# EAGLE design Cube (EAGLE 9.6.2)
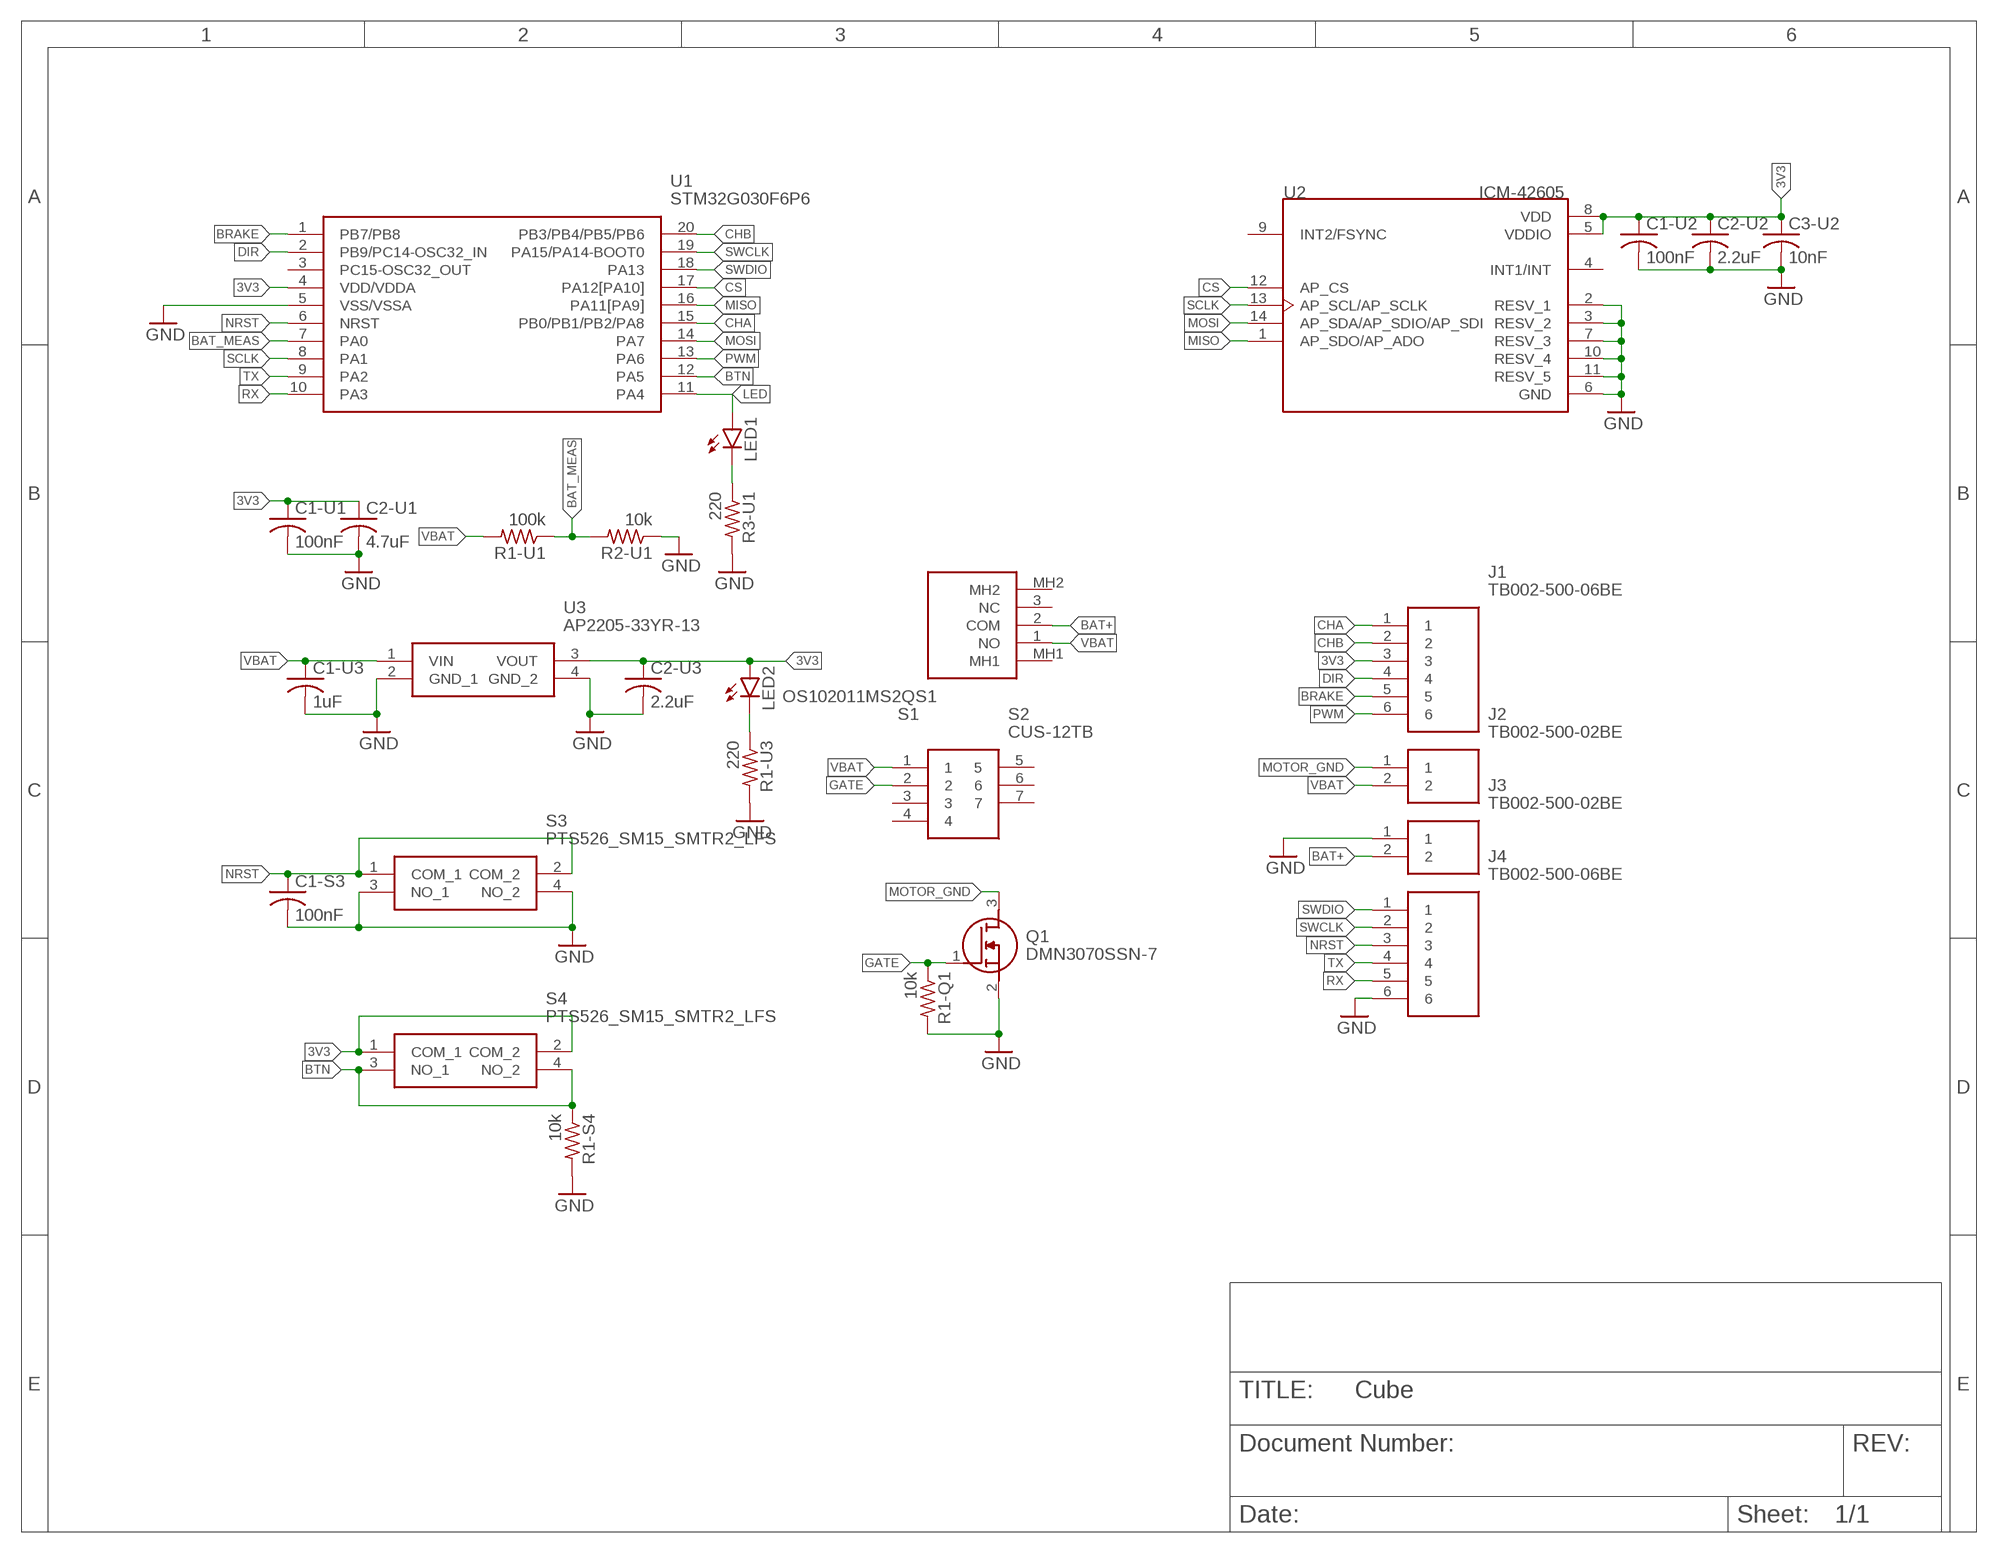
[diagram p0: schematic, sheet 1]

## Parts
C1-S3  100nF  C-USC0805  [C0805]
C1-U1  100nF  C-USC0805  [C0805]
C1-U2  100nF  C-USC0805  [C0805]
C1-U3  1uF  C-USC0805  [C0805]
C2-U1  4.7uF  C-USC0805  [C0805]
C2-U2  2.2uF  C-USC0805  [C0805]
C2-U3  2.2uF  C-USC0805  [C0805]
C3-U2  10nF  C-USC0805  [C0805]
J1  TB002-500-06BE  [TB00250006BE]
J2  TB002-500-02BE  [TB00250002BE]
J3  TB002-500-02BE  [TB00250002BE]
J4  TB002-500-06BE  [TB00250006BE]
LED1  LEDCHIP-LED0805  [CHIP-LED0805]
LED2  LEDCHIP-LED0805  [CHIP-LED0805]
Q1  DMN3070SSN-7  [SOT95P285X140-3N]
R1-Q1  10k  R-US_R0805  [R0805]
R1-S4  10k  R-US_R0805  [R0805]
R1-U1  100k  R-US_R0805  [R0805]
R1-U3  220  R-US_R0805  [R0805]
R2-U1  10k  R-US_R0805  [R0805]
R3-U1  220  R-US_R0805  [R0805]
S1  OS102011MS2QS1  [OS102011MS2QS1]
S2  CUS-12TB  [CUS-12B]
S3  PTS526_SM15_SMTR2_LFS  [PTS526SM15SMTR2LFS]
S4  PTS526_SM15_SMTR2_LFS  [PTS526SM15SMTR2LFS]
U1  STM32G030F6P6  [SOP65P640X120-20N]
U2  ICM-42605  [PQFN50P300X250X97-14N]
U3  AP2205-33YR-13  [AP220533YR13]

## Nets
3V3: C1-U1.1 C1-U2.1 C2-U1.1 C2-U2.1 C2-U3.1 C3-U2.1 J1.3 LED2.A S4.1(COM_1) S4.2(COM_2) U1.4(VDD/VDDA) U2.5(VDDIO) U2.8(VDD) U3.3(VOUT)
BAT+: J3.2 S1.2(COM)
BAT_MEAS: R1-U1.1 R2-U1.2 U1.7(PA0)
BRAKE: J1.5 U1.1(PB7/PB8)
BTN: R1-S4.1 S4.3(NO_1) S4.4(NO_2) U1.12(PA5)
CHA: J1.1 U1.15(PB0/PB1/PB2/PA8)
CHB: J1.2 U1.20(PB3/PB4/PB5/PB6)
CS: U1.17(PA12[PA10]) U2.12(AP_CS)
DIR: J1.4 U1.2(PB9/PC14-OSC32_IN)
GATE: Q1.1(G) R1-Q1.1 S2.2
GND: C1-S3.2 C1-U1.2 C1-U2.2 C1-U3.2 C2-U1.2 C2-U2.2 C2-U3.2 C3-U2.2 J3.1 J4.6 Q1.2(S) R1-Q1.2 R1-S4.2 R1-U3.2 R2-U1.1 R3-U1.2 S3.3(NO_1) S3.4(NO_2) U1.5(VSS/VSSA) U2.2(RESV_1) U2.3(RESV_2) U2.6(GND) U2.7(RESV_3) U2.10(RESV_4) U2.11(RESV_5) U3.2(GND_1) U3.4(GND_2)
LED: LED1.A U1.11(PA4)
LED1-R: LED1.C R3-U1.1
LED2-R: LED2.C R1-U3.1
MISO: U1.16(PA11[PA9]) U2.1(AP_SDO/AP_ADO)
MOSI: U1.14(PA7) U2.14(AP_SDA/AP_SDIO/AP_SDI)
MOTOR_GND: J2.1 Q1.3(D)
NRST: C1-S3.1 J4.3 S3.1(COM_1) S3.2(COM_2) U1.6(NRST)
PWM: J1.6 U1.13(PA6)
RX: J4.5 U1.10(PA3)
SCLK: U1.8(PA1) U2.13(AP_SCL/AP_SCLK)
SWCLK: J4.2 U1.19(PA15/PA14-BOOT0)
SWDIO: J4.1 U1.18(PA13)
TX: J4.4 U1.9(PA2)
VBAT: C1-U3.1 J2.2 R1-U1.2 S1.1(NO) S2.1 U3.1(VIN)
Unconnected: S1.3(NC) S1.MH1 S1.MH2 S2.3 S2.4 S2.5 S2.6 S2.7 U1.3(PC15-OSC32_OUT) U2.4(INT1/INT) U2.9(INT2/FSYNC)

## Library data of the parts
C1-S3 C1-U1-C1-U3 C2-U1-C2-U3 C3-U2 = rcl:C-US: CAPACITOR, American symbol; SPICEPREFIX: C
J1 J4 = SamacSys_Parts:TB002-500-06BE: Fixed Terminal Blocks screw type, 5.00 , horizontal, 6 poles, CUI Blue, slotted screw, PCB mount Source: Datasheet <https://componentsearchengine.com/Datasheets/1/TB002-500-06BE.pdf>; DESCRIPTION: Fixed Terminal Blocks screw type, 5.00 , horizontal, 6 poles, CUI Blue, slotted screw, PCB mount; HEIGHT: 10.4mm; MANUFACTURER_NAME: CUI Inc.; MANUFACTURER_PART_NUMBER: TB002-500-06BE; MOUSER_PART_NUMBER: 490-TB002-500-06BE; MOUSER_PRICE-STOCK: https://www.mouser.co.uk/ProductDetail/CUI-Devices/TB002-500-06BE?qs=vLWxofP3U2ySaC9Fwbz1OQ%3D%3D
J2 J3 = SamacSys_Parts:TB002-500-02BE: Fixed Terminal Blocks Terminal block, screw type, 5.00, horizontal, 2 poles, CUI Blue, slotted screw, PCB mount Source: Datasheet; DESCRIPTION: Fixed Terminal Blocks Terminal block, screw type, 5.00, horizontal, 2 poles, CUI Blue, slotted screw, PCB mount; HEIGHT: 10.4mm; MANUFACTURER_NAME: CUI Inc.; MANUFACTURER_PART_NUMBER: TB002-500-02BE; MOUSER_PART_NUMBER: 490-TB002-500-02BE; MOUSER_PRICE-STOCK: https://www.mouser.co.uk/ProductDetail/CUI-Devices/TB002-500-02BE?qs=vLWxofP3U2x9716kcgva%2Fw%3D%3D
LED1 LED2 = led:LED: LED OSRAM: - CHIPLED LG R971, LG N971, LY N971, LG Q971, LY Q971, LO R971, LY R971 LH N974, LH R974 LS Q976, LO Q976, LY Q976 LO Q996 - Hyper CHIPLED LW Q18S LB Q993, LB Q99A, LB R99A - SideLED LS A670, LO A670, LY A670, LG A670, LP A670 LB A673, LV A673, LT A673, LW A673 LH A674 LY A675 LS A676, LA A676, LO A676, LY A676, LW A676 LS A679, LY A679, LG A679 - Hyper Micro SIDELED® LS Y876, LA Y876, LO Y876, LY Y876 LT Y87S - SmartLED LW L88C, LW L88S LB L89C, LB L89S, LG L890 LS L89K, LO L89K, LY L89K LS L896, LA L896, LO L896, LY L896 - TOPLED LS T670, LO T670, LY T670, LG T670, LP T670 LSG T670, LSP T670, LSY T670, LOP T670, LYG T670 LG T671, LOG T671, LSG T671 LB T673, LV T673, LT T673, LW T673 LH T674 LS T676, LA T676, LO T676, LY T676, LB T676, LH T676, LSB T676, LW T676 LB T67C, LV T67C, LT T67C, LS T67K, LO T67K, LY T67K, LW E67C LS E67B, LA E67B, LO E67B, LY E67B, LB E67C, LV E67C, LT E67C LW T67C LS T679, LY T679, LG T679 LS T770, LO T770, LY T770, LG T770, LP T770 LB T773, LV T773, LT T773, LW T773 LH T774 LS E675, LA E675, LY E675, LS T675 LS T776, LA T776, LO T776, LY T776, LB T776 LHGB T686 LT T68C, LB T68C - Hyper Mini TOPLED® LB M676 - Mini TOPLED Santana® LG M470 LS M47K, LO M47K, LY M47K Source: http://www.osram.convergy.de LUXEON: - LUMILED® LXK2-PW12-R00, LXK2-PW12-S00, LXK2-PW14-U00, LXK2-PW14-V00 LXK2-PM12-R00, LXK2-PM12-S00, LXK2-PM14-U00 LXK2-PE12-Q00, LXK2-PE12-R00, LXK2-PE12-S00, LXK2-PE14-T00, LXK2-PE14-U00 LXK2-PB12-K00, LXK2-PB12-L00, LXK2-PB12-M00, LXK2-PB14-N00, LXK2-PB14-P00, LXK2-PB14-Q00 LXK2-PR12-L00, LXK2-PR12-M00, LXK2-PR14-Q00, LXK2-PR14-R00 LXK2-PD12-Q00, LXK2-PD12-R00, LXK2-PD12-S00 LXK2-PH12-R00, LXK2-PH12-S00 LXK2-PL12-P00, LXK2-PL12-Q00, LXK2-PL12-R00 Source: www.luxeon.com KINGBRIGHT: KA-3528ASYC Source: www.kingbright.com
Q1 = SamacSys_Parts:DMN3070SSN-7: Diodes Inc DMN3070SSN-7 N-channel MOSFET Transistor, 5.1 A, 30 V, 3-Pin SC-59 Source: Datasheet <https://www.diodes.com/assets/Datasheets/DMN3070SSN.pdf>; DESCRIPTION: Diodes Inc DMN3070SSN-7 N-channel MOSFET Transistor, 5.1 A, 30 V, 3-Pin SC-59; HEIGHT: 1.4mm; MANUFACTURER_NAME: Diodes Inc.; MANUFACTURER_PART_NUMBER: DMN3070SSN-7; MOUSER_PART_NUMBER: 621-DMN3070SSN-7; MOUSER_PRICE-STOCK: https://www.mouser.co.uk/ProductDetail/Diodes-Incorporated/DMN3070SSN-7?qs=%252BSlWJf1dfkL0soPvBL8r%2FQ%3D%3D
R1-Q1 R1-S4 R1-U1 R1-U3 R2-U1 R3-U1 = rcl:R-US_: RESISTOR, American symbol; SPICEPREFIX: R
S1 = SamacSys_Parts:OS102011MS2QS1: C & K COMPONENTS - OS102011MS2QS1 - SWITCH SLIDE SHORTING SPDT Source: Datasheet <https://www.ckswitches.com/media/1428/os.pdf>; DESCRIPTION: C & K COMPONENTS - OS102011MS2QS1 - SWITCH SLIDE SHORTING SPDT; HEIGHT: 8.7mm; MANUFACTURER_NAME: C & K COMPONENTS; MANUFACTURER_PART_NUMBER: OS102011MS2QS1; MOUSER_PART_NUMBER: 611-OS102011MS2QS1; MOUSER_PRICE-STOCK: https://www.mouser.co.uk/ProductDetail/CK/OS102011MS2QS1?qs=WtljUlYws5TrGs9OfHrZYw%3D%3D
S2 = SamacSys_Parts:CUS-12TB: LOW-PROFILE SLIDE SWITCHES Source: Datasheet <http://www.nidec-copal-electronics.com/e/catalog/switch/cus.pdf>; DESCRIPTION: LOW-PROFILE SLIDE SWITCHES; HEIGHT: mm; MANUFACTURER_NAME: Copal Electronics; MANUFACTURER_PART_NUMBER: CUS-12TB
S3 S4 = SamacSys_Parts:PTS526_SM15_SMTR2_LFS: Tactile Switches 50mA 12VDC, 5.2x5.2mm, 1.5mm H, 160gf, G leads, No ground pin, metal actuator Source: Datasheet; DESCRIPTION: Tactile Switches 50mA 12VDC, 5.2x5.2mm, 1.5mm H, 160gf, G leads, No ground pin, metal actuator; HEIGHT: 1.5mm; MANUFACTURER_NAME: C & K COMPONENTS; MANUFACTURER_PART_NUMBER: PTS526 SM15 SMTR2 LFS; MOUSER_PART_NUMBER: 611-PTS526SM15SMTR2L; MOUSER_PRICE-STOCK: https://www.mouser.co.uk/ProductDetail/CK/PTS526-SM15-SMTR2-LFS?qs=UXgszm6BlbENivbslIA%252B5g%3D%3D
U1 = SamacSys_Parts:STM32G030F6P6: ARM Microcontrollers - MCU Source: Datasheet <https://componentsearchengine.com/Datasheets/1/STM32G030F6P6.pdf>; DESCRIPTION: ARM Microcontrollers - MCU; HEIGHT: 1.2mm; MANUFACTURER_NAME: STMicroelectronics; MANUFACTURER_PART_NUMBER: STM32G030F6P6; MOUSER_PART_NUMBER: 511-STM32G030F6P6; MOUSER_PRICE-STOCK: https://www.mouser.co.uk/ProductDetail/STMicroelectronics/STM32G030F6P6?qs=uwxL4vQweFOQRcVHghCbHA%3D%3D
U2 = ICM-42605:ICM-42605: Single-Interface MotionTracking device The ICM-42605 is a 6-axis MotionTracking device that combines a 3-axis gyroscope, and a 3-axis accelerometer in a small 2.5x3x0.91 mm (14-pin LGA) package. It also features a 2K-byte FIFO that can lower the traffic on the serial bus interface, and reduce power consumption by allowing the system processor to burst read sensor data and then go into a low-power mode. Check availability <https://pricing.snapeda.com/parts/ICM-42605/TDK%20InvenSense/view-part?ref=eda>; AVAILABILITY: In Stock; DESCRIPTION: Accelerometer, Gyroscope, 6 Axis Sensor I²C, I3C℠, SPI Output; MF: TDK InvenSense; MP: ICM-42605; PACKAGE: - TDK InvenSense; PRICE: None; PURCHASE-URL: https://pricing.snapeda.com/search/part/ICM-42605/?ref=eda
U3 = SamacSys_Parts:AP2205-33YR-13: LDO Voltage Regulators LDO CMOS LowCurr Source: Datasheet <https://www.diodes.com/assets/Datasheets/AP2205.pdf>; DESCRIPTION: LDO Voltage Regulators LDO CMOS LowCurr; HEIGHT: 1.6mm; MANUFACTURER_NAME: Diodes Inc.; MANUFACTURER_PART_NUMBER: AP2205-33YR-13; MOUSER_PART_NUMBER: 621-AP2205-33YR-13; MOUSER_PRICE-STOCK: https://www.mouser.co.uk/ProductDetail/Diodes-Incorporated/AP2205-33YR-13?qs=EBDBlbfErPxr2Yd8HvuLMQ%3D%3D

## Board
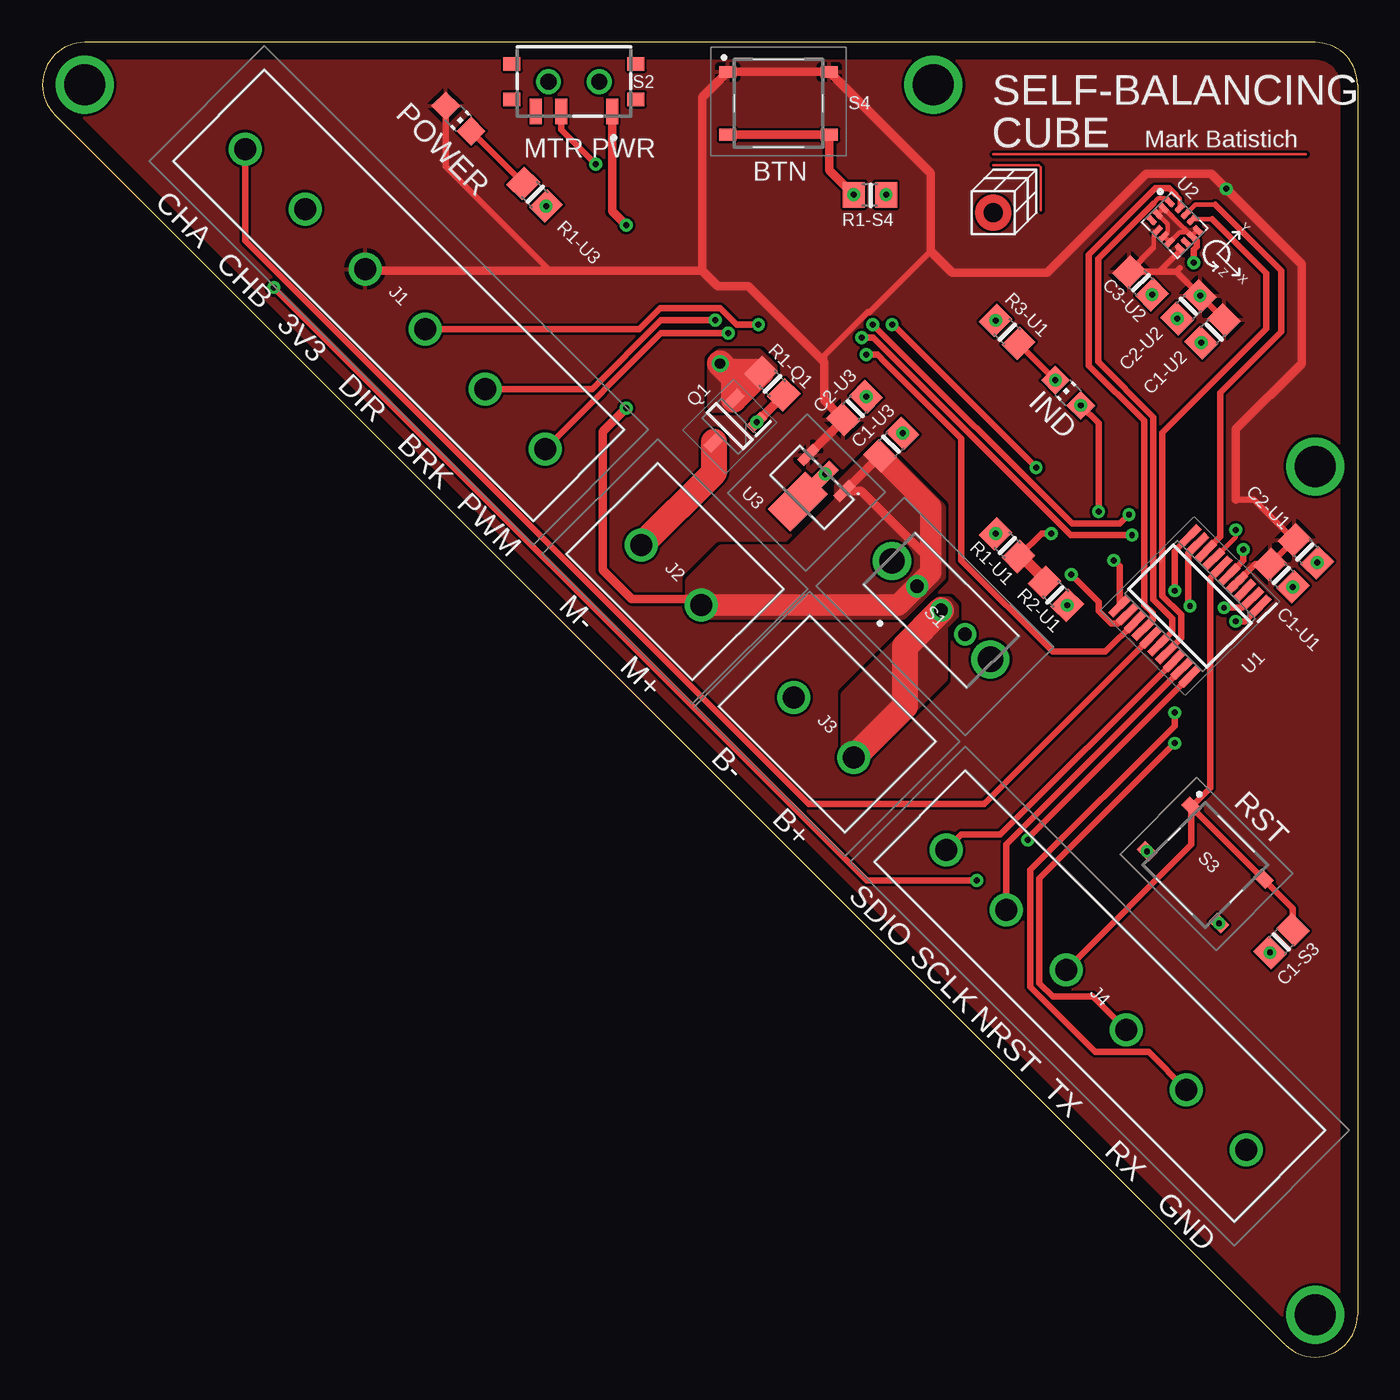
[diagram p1: board, top side]
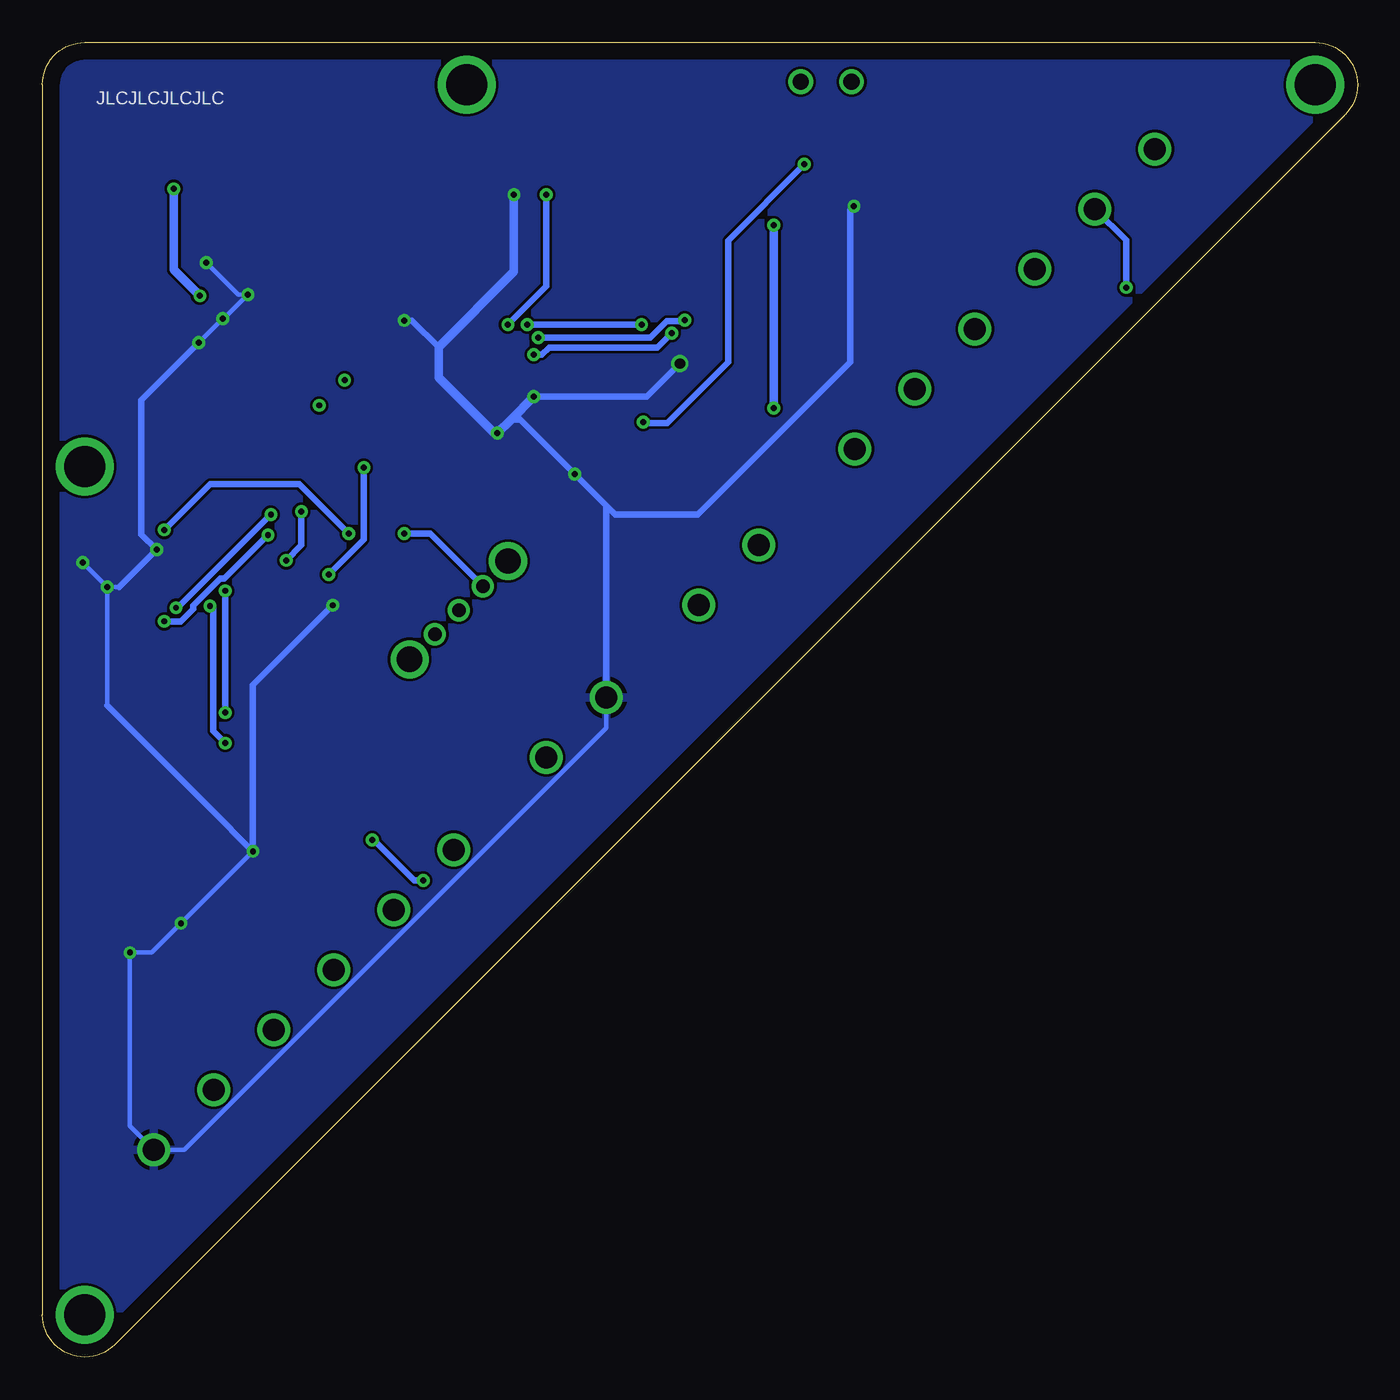
[diagram p2: board, bottom side, seen from below]

Size 77.5 x 77.5 mm. Coordinates in mm from the lower left corner, seen from the top.
Outline: 74.99,77.5 2.5,77.5 arc135 0.73,73.23 73.23,0.73 arc135 77.49,2.5 77.49,75 arc90 74.99,77.5
Copper layers (1*16): Top 0.035mm / dielectric 1.5mm / Bottom 0.035mm
Design rules "default": minimum track width 6mil, minimum drill 0.35mm, track to track 6mil, track to pad 6mil, pad to pad 6mil, via to via 6mil, smd to smd 6mil, copper to edge 40mil, drill to drill 6mil, minimum pad ring 10mil, minimum via ring 8mil, stop-mask expansion 4mil, vias tented up to drill 0mil, thermal gap 10mil

### Footprints (pad centres in the part's own frame; a part is rotated, then mirrored left to right if it is on the bottom)
C0805 = smd 1.3 x 1.5: 1 -0.95,0; 2 0.95,0
TB00250006BE = drill 1.3 pad 1.95: 1 0,0; 2 5,0; 3 10,0; 4 15,0; 5 20,0; 6 25,0
TB00250002BE = drill 1.3 pad 1.95: 1 0,0; 2 5,0
CHIP-LED0805 = smd 1.2 x 1.2: A 0,-1.05; C 0,1.05
SOT95P285X140-3N = smd 1.15 x 0.6: 1 -1.3,0.95; 2 -1.3,-0.95; 3 1.3,0
R0805 = smd 1.3 x 1.5: 1 -0.95,0; 2 0.95,0
OS102011MS2QS1 = drill 0.8 pad 1.3: 1 0,0; 2 2,0; 3 4,0 | drill 1.5 pad 2.25: MH1 -2.1,0; MH2 6.1,0
CUS-12B = smd 0.7 x 1.5: 1 -2.25,1.75; 2 0.75,1.75; 3 2.25,1.75 | smd 1 x 0.8: 4 3.65,1.05; 5 3.65,-1.05; 6 -3.65,-1.05; 7 -3.65,1.05 | drill 0.95 pad 1.45: 8 -1.5,0; 9 1.5,0
PTS526SM15SMTR2LFS = smd 1 x 0.7: 1 -3,1.85; 2 3,1.85; 3 -3,-1.85; 4 3,-1.85
SOP65P640X120-20N = smd 1.475 x 0.45: 1 -2.938,2.925; 2 -2.938,2.275; 3 -2.938,1.625; 4 -2.938,0.975; 5 -2.938,0.325; 6 -2.938,-0.325; 7 -2.938,-0.975; 8 -2.938,-1.625; 9 -2.938,-2.275; 10 -2.938,-2.925; 11 2.938,-2.925; 12 2.938,-2.275; 13 2.938,-1.625; 14 2.938,-0.975; 15 2.938,-0.325; 16 2.938,0.325; 17 2.938,0.975; 18 2.938,1.625; 19 2.938,2.275; 20 2.938,2.925
PQFN50P300X250X97-14N = smd 0.61 x 0.35: 1 -1.16,0.75; 2 -1.16,0.25; 3 -1.16,-0.25; 4 -1.16,-0.75; 8 1.16,-0.75; 9 1.16,-0.25; 10 1.16,0.25; 11 1.16,0.75 | smd 0.35 x 0.61: 5 -0.5,-0.91; 6 0,-0.91; 7 0.5,-0.91; 12 0.5,0.91; 13 0,0.91; 14 -0.5,0.91
AP220533YR13 = smd 0.55 x 1.3: 1 -1.5,-1.192; 3 1.5,-1.192 | smd 0.8 x 1.475: 2 0,-1.102 | smd 1.85 x 3.125: 4 0,1.192

### Placement (x,y rotation side)
C1-S3  73.01,24.51 225 top
C1-U1  73.01,46.07 315 top
C1-U2  68.96,60.47 225 top
C1-U3  50.02,53.79 45 top
C2-U1  74.44,47.5 315 top
C2-U2  67.54,61.88 225 top
C2-U3  47.86,55.95 45 top
C3-U2  64.71,63.3 315 top
J1  11.94,71.21 315 top
J2  35.29,47.86 315 top
J3  44.27,38.88 315 top
J4  53.25,29.9 315 top
LED1  60.44,56.84 45 top
LED2  24.51,73.01 225 top
Q1  40.5,54.87 225 top
R1-Q1  43.01,57.38 135 top
R1-S4  48.76,68.52 0 top
R1-U1  56.84,47.86 135 top
R1-U3  29,68.52 315 top
R2-U1  59.72,44.99 135 top
R3-U1  56.84,60.44 135 top
S1  51.54,45.44 315 top
S2  31.32,75.18 180 top
S3  68.52,29 315 top
S4  43.37,73.91 0 top
U1  67.62,44.27 225 top
U2  66.72,66.72 315 top
U3  45.35,51.28 135 top

### Tracks (layer width: path | path; a pad name or v marks a point on that pad's centre or on a via)
3V3  (via drill 0.35)
  Top 0.254: 64.06,63.99 C3-U2.1 | 65.43,65.36 65.5,65.42 65.5,66.14 65.72,66.37 U2.5 | C1-U2.1
  Top 0.381: C1-U2.1 C2-U2.1 66.8,63.97 | 65.43,65.36 64.06,63.99 | 66.8,63.97 65.81,63.97 | 65.81,63.97 C3-U2.1 | 66.8,63.97 67.01,64.18 | 29.9,64.03 23.77,70.16 LED2.A | U1.4 71.47,46.74 C1-U1.1 C2-U1.1 | C2-U1.1 | C2-U1.1 71.39,50.56 70.31,50.56 | 52.35,65.18 48.75,61.58 48.62,61.58 46.07,59.03 46.07,58.64 | 65.81,63.97 67,65.16 67,65.36
  Top 0.508: U3.3 47.19,55.24 C2-U3.1 46.07,56.4 46.07,58.64 41.58,63.13 39.78,63.13 38.88,64.03 | 38.88,64.03 29.9,64.03 19.13,64.03 J1.3 | 38.88,64.03 38.88,74.27 S4.1 S4.2 52.35,69.78 52.35,65.18 53.62,63.91 59.21,63.91 65.05,69.75 68.86,69.75 v69.75,68.86 74.2,64.42 74.2,58.58 70.31,54.69 70.31,50.56
  Bottom 0.508: v69.75,68.86 69.75,64.09 C2-U2.1
  other vias: 68.21,62.56
  pour Top (rank 2): 77.5,77.63 77.5,-3.15 -3.02,77.37 77.24,77.37
BAT+
  Top 1.524: J3.2 50.83,38.37 50.83,41.89 S1.2
  pour Top (no thermals): 47.27,35.46 47.27,39.02 52.61,44.35 52.86,44.61 53.37,44.61 53.75,44.22 53.75,44.1 53.75,43.72 53.62,43.59 53.11,43.08 53.11,42.45 53.11,40.03 48.03,34.95 47.91,34.83 47.53,34.83 47.27,35.08 47.27,35.33
BAT_MEAS  (via drill 0.35)
  Top 0.254: U1.7 | v70.31,48.76 70.31,48.34 U1.7
  Top 0.381: R1-U1.1 R2-U1.2 59.04,46.07 57.92,47.19 R1-U1.1 | R1-U1.1 58.87,48.55 v59.45,48.55
  Bottom 0.381: v70.31,48.76 67.62,51.46 62.35,51.46 v59.45,48.55
BRAKE  (via drill 0.35)
  Top 0.381: v64.2,48.46 60.59,48.46 49.1,59.95 48.95,60.1 v48.29,60.1 | J1.5 32.4,57.07 36.45,61.12 v39.65,61.12 | U1.1 70.86,43.37 v70.31,43.37
  Bottom 0.381: v64.2,48.46 66.78,45.89 67.02,45.89 68.61,44.3 68.61,44.1 69.33,43.37 v70.31,43.37 | v39.65,61.12 39.69,61.07 40.71,61.07 41.69,60.1 v48.29,60.1
BTN  (via drill 0.35)
  Top 0.381: U1.12 63.37,43.24 62.97,43.24 62.23,43.98 62.23,44.51 v60.61,46.12 | v58.55,52.44 50.13,60.86 v50.07,60.86
  Top 0.508: R1-S4.1 46.37,69.96 S4.4 S4.3
  Bottom 0.381: v60.61,46.12 58.55,48.19 v58.55,52.44 | v50.07,60.86 47.81,63.12 R1-S4.1
  other vias: 47.81,68.52
CHA
  Top 0.381: J1.1 11.94,68.74 11.94,65.82 43.74,34.03 45.17,32.6 55.49,32.6 U1.15
CHB  (via drill 0.35)
  Top 0.381: U1.20 58.06,30.58 v58.06,30.48 | v55.05,28.11 48.58,28.11 v13.64,63.05
  Bottom 0.381: v58.06,30.48 57.96,30.48 55.59,28.11 v55.05,28.11 | v13.64,63.05 13.64,65.83 J1.2
CS
  Top 0.254: 68.92,67.08 67.78,67.08 U2.12
  Top 0.381: U1.17 67.11,42.38 67.11,43.76 66,44.87 66,54.51 72.11,60.61 72.11,63.89 68.92,67.08
DIR  (via drill 0.35)
  Top 0.381: v69.62,44.17 v69.63,44.18 70.74,44.18 U1.2 | v64.03,49.66 63.49,49.12 60.69,49.12 49.32,60.49 48.95,60.86 v48.92,60.86 | J1.4 35.18,60.61 36.08,61.5 36.41,61.84 39.95,61.84 40.93,60.86 v42.19,60.86
  Bottom 0.381: v69.62,44.17 69.52,44.17 v64.03,49.66 | v48.92,60.86 v42.19,60.86
GATE  (via drill 0.35)
  Top 0.381: S2.2 30.57,72.34 v32.6,70.31
  Top 0.508: Q1.1 R1-Q1.1
  Bottom 0.381: v32.6,70.31 37.09,65.82 37.09,58.64 40.68,55.05 42.02,55.05 Q1.1
  other vias: 42.09,55.11
GND  (via drill 0.35, 0.6)
  Top 0.254: U2.10 66.9,66.9 U2.2 U2.3 66.31,66.78 66.31,66.33 66.08,66.1 U2.6 U2.7 67.01,66.31 67.42,66.31 67.65,66.08 U2.10 | U2.11 67.73,66.09 U2.10 | U3.4 U3.2
  Top 0.381: v70.76,47.59 70.76,46.95 U1.5 | v67.84,64.51 67.84,65.28 68.01,65.45 68.01,65.81 67.73,66.09
  Top 1.524: v39.93,58.56 40.75,57.74 Q1.2 R1-Q1.2 40.44,58.05 v39.93,58.56
  Bottom 0.254: C1-U2.2 C2-U2.2 66.8,61.21 C3-U2.2 65.95,62.63 v67.84,64.51 | J3.1 44.27,37.09 69.13,12.22 J4.6 72.34,13.63 C1-S3.2 71.06,23.84 S3.4 S3.3 | 72.96,45.4 C1-U1.2 | C1-U1.2 C2-U1.2 | C2-U1.2 | C1-U1.2 73.68,38.41 | 73.68,38.41
  Bottom 0.381: C1-U2.2 71.66,56.42 71.66,48.49 v70.76,47.59 72.96,45.4 | 73.68,38.41 67.65,32.38 S3.3 65.09,39.62 R2-U1.1 | v39.93,58.56 41.87,56.62 C2-U3.2 | 49.88,55.27 49.34,55.27 U3.2 44.27,50.2 | J3.1 44.27,50.2 | 44.27,50.2 43.73,49.66 38.88,49.66 29.9,58.64 29.9,67.62 R1-U3.2 | R3-U1.2 55.72,61.11 54.15,59.54
  Bottom 0.508: R1-S4.2 49.71,63.98 54.15,59.54 54.15,57.74 50.87,54.46 C1-U3.2 49.88,55.27 C2-U3.2
  other vias: 65.09,29.82 65.38,62.63 66.87,61.21 68.28,59.8 60.39,44.32 49.71,68.52 50.69,54.46 48.53,56.62 46.13,52.05 29.68,67.85 56.17,61.11 75.12,46.83 73.68,45.4 69.33,25.57 72.34,23.84
  pour Bottom: 0.79,73.91 76.97,-2.27 76.97,76.97 1.54,76.97
  pour Top (no thermals): 66,67.8 65.64,67.44 66.27,66.81 66.27,66.27 66.09,66.09 66.45,65.73 66.99,66.27 67.35,66.27 67.44,66.36 67.71,66.09 68.07,66.45 67.98,66.54 67.26,66.54
  pour Top (no thermals): 39.4,58.58 39.4,56.04 39.52,55.91 40.79,55.91 43.08,58.19 43.08,58.32 42.19,59.21 41.68,59.21 39.91,59.21 39.4,58.7
LED  (via drill 0.35)
  Top 0.381: U1.11 63.47,46.62 v63.13,46.96 | LED1.A 62.23,55.05 v62.23,49.84
  Bottom 0.381: v63.13,46.96 62.23,47.86 v62.23,49.84
  other vias: 61.18,56.1
LED1-R  (via drill 0.35)
  Top 0.381: R3-U1.1 LED1.C
  other vias: 59.69,57.59
LED2-R
  Top 0.381: LED2.C R1-U3.1
MISO
  Top 0.254: U2.1 66.37,68.07 66.14,68.3 65.74,68.3 65.44,68
  Top 0.381: U1.16 66.58,42.77 66.58,43.54 65.47,44.65 65.47,55.4 62.2,58.67 62.2,64.76 65.44,68
MOSI
  Top 0.254: U2.14 67.01,67.83 67.01,68.27 66.74,68.54
  Top 0.381: U1.14 65.42,43.45 65.42,43.85 64.93,44.34 64.93,55.19 61.67,58.45 61.67,64.98 65.59,68.9 66.39,68.9 66.74,68.54
MOTOR_GND
  Top 1.524: J2.1 39.58,52.15 Q1.3
N$1  (via drill 2.41)
  other vias: 52.5,75
N$2  (via drill 2.41)
  other vias: 2.5,75
N$3  (via drill 2.41)
  other vias: 75,2.5
N$4  (via drill 2.41)
  other vias: 75,52.5
N$5
  Top 0.152: 56.03,70.26 58.7,70.26 58.83,70.13 58.83,67.59
N$6
  Top 0.152: 56.03,70.89 74.45,70.89
NRST
  Top 0.381: S3.1 68.81,33.54 68.81,45.92 U1.6 | J4.3 67.7,30.21 S3.1 | S3.1 S3.2 73.68,26.46 C1-S3.1 | U1.6
PWM  (via drill 0.35)
  Top 0.381: U1.13 62.63,41.58 59.54,41.58 54.15,46.96 54.15,54.15 49.64,58.66 49.21,59.08 v48.54,59.08 | J1.6 36.44,60.35 v40.41,60.35
  Bottom 0.381: v48.54,59.08 48.06,59.08 47.63,59.52 41.25,59.52 v40.41,60.35
RX  (via drill 0.35)
  Top 0.381: U1.10 66.72,47.51 v66.72,45.17 | J4.5 65.18,17.98 62.05,17.98 58.22,21.81 58.22,28.7 66.72,37.21 v66.72,37.98
  Bottom 0.381: v66.72,45.17 v66.72,37.98
SCLK
  Top 0.254: 69.11,67.93 67.93,67.93 U2.13
  Top 0.381: U1.8 69.42,48.37 69.42,56.84 73.01,60.44 73.01,64.03 69.11,67.93
SWCLK
  Top 0.381: U1.19 56.79,30.22 J4.2
SWDIO
  Top 0.381: U1.18 56.45,30.8 54.15,30.8 J4.1
TX  (via drill 0.35)
  Top 0.381: v66.72,36.19 58.75,28.22 58.75,22.03 59.52,21.26 61.89,21.26 J4.4 | v67.62,44.27 67.52,44.37 67.52,47.39 U1.9
  Bottom 0.381: v66.72,36.19 67.44,36.91 67.44,44.09 v67.62,44.27
VBAT  (via drill 0.35)
  Top 0.508: C1-U3.1 47.29,51.06 U3.1 48.26,51.06 52.35,46.96 | S2.1 33.57,67.55 v34.39,66.72 | J2.2 38.47,44.69 34.72,44.69 33.01,46.39 33.01,54.56 v34.39,55.95
  Top 1.27: C1-U3.1 52.35,50.11 52.35,46.96 52.35,46.25 S1.1 50.43,44.33 J2.2
  Bottom 0.381: R1-U1.2 54.64,48.53 S1.1
  Bottom 0.508: v34.39,66.72 v34.39,55.95
  other vias: 56.17,48.53
  pour Top (no thermals): 38.76,43.72 50.7,43.72 52.99,46 52.99,50.07 50.95,52.1 49.3,53.75 46.89,51.34 46.89,50.7 46.89,50.45 45.24,48.8 44.1,47.65 42.06,47.65 40.03,47.65 38.89,46.51 38.13,45.75 38.13,44.61 38.13,44.35
(copper drawn outside any net)
  shapes: Top circle x1

### Text on the board
tNames: POWER | SELF-BALANCING | CUBE | Mark Batistich | MTR PWR | BTN | CHA | Y | CHB | Z | X | 3V3 | DIR | IND | BRK | PWM | M- | M+ | B- | RST | B+ | SDIO | SCLK | NRST | TX | RX | GND
bNames: JLCJLCJLCJLC